# EasyEDA Pro project 毕业设计.eprj, board PCB1
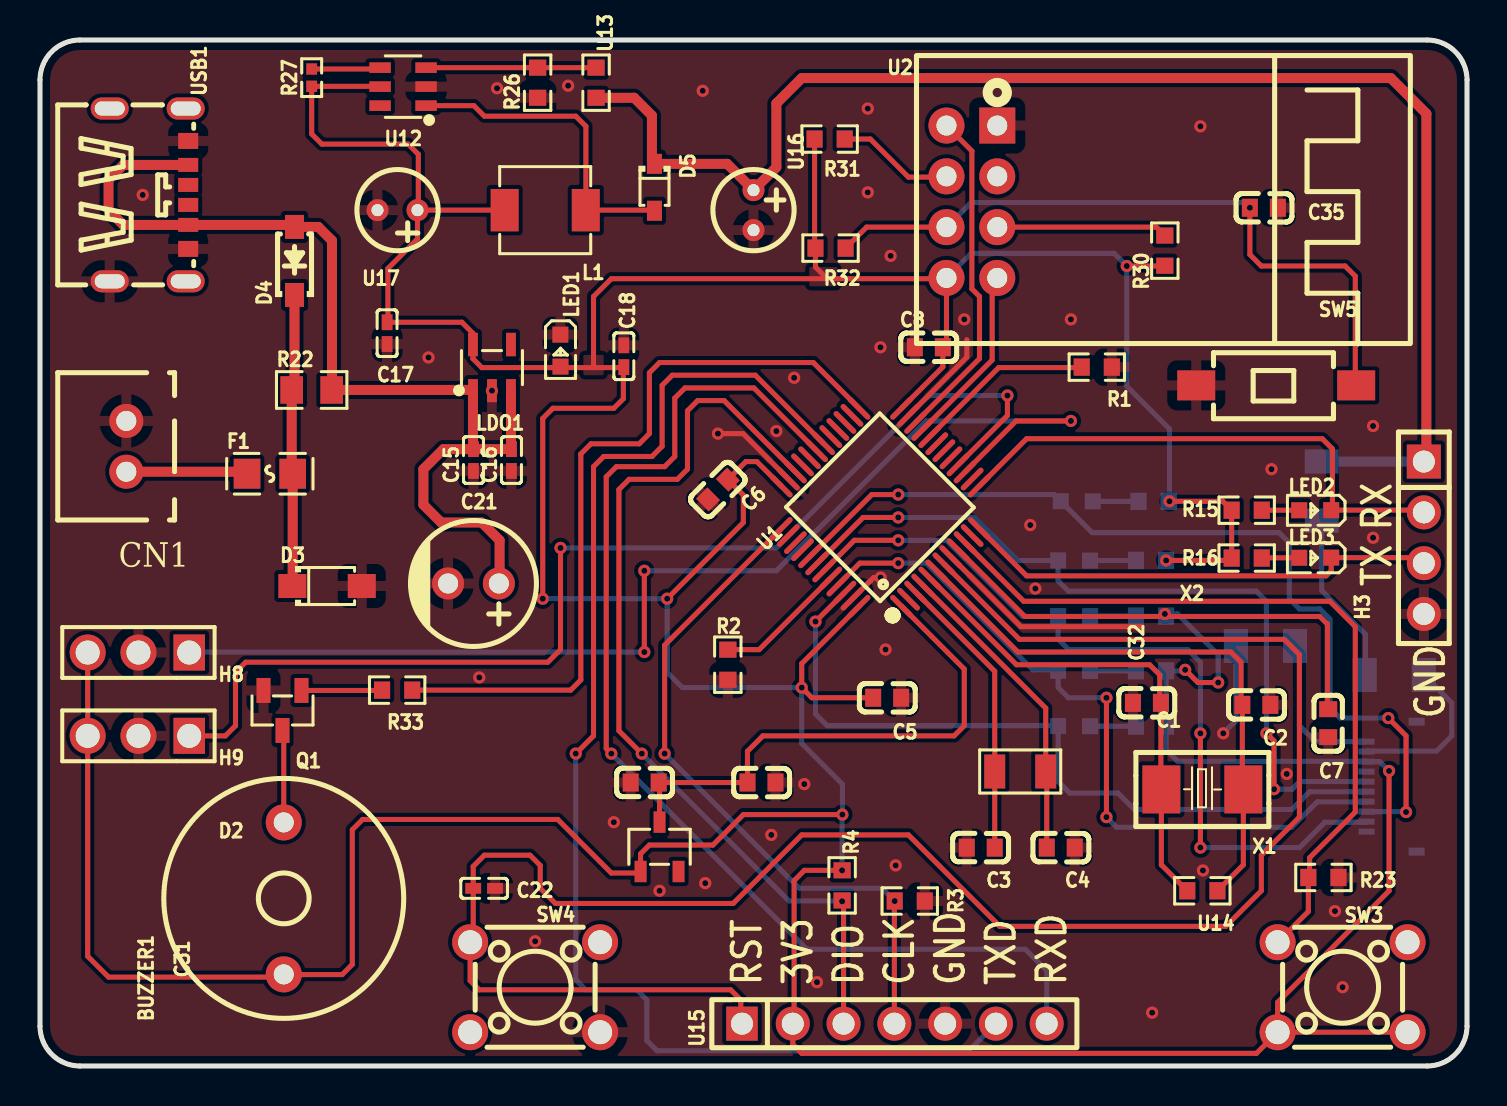
[diagram p3: board, top side]
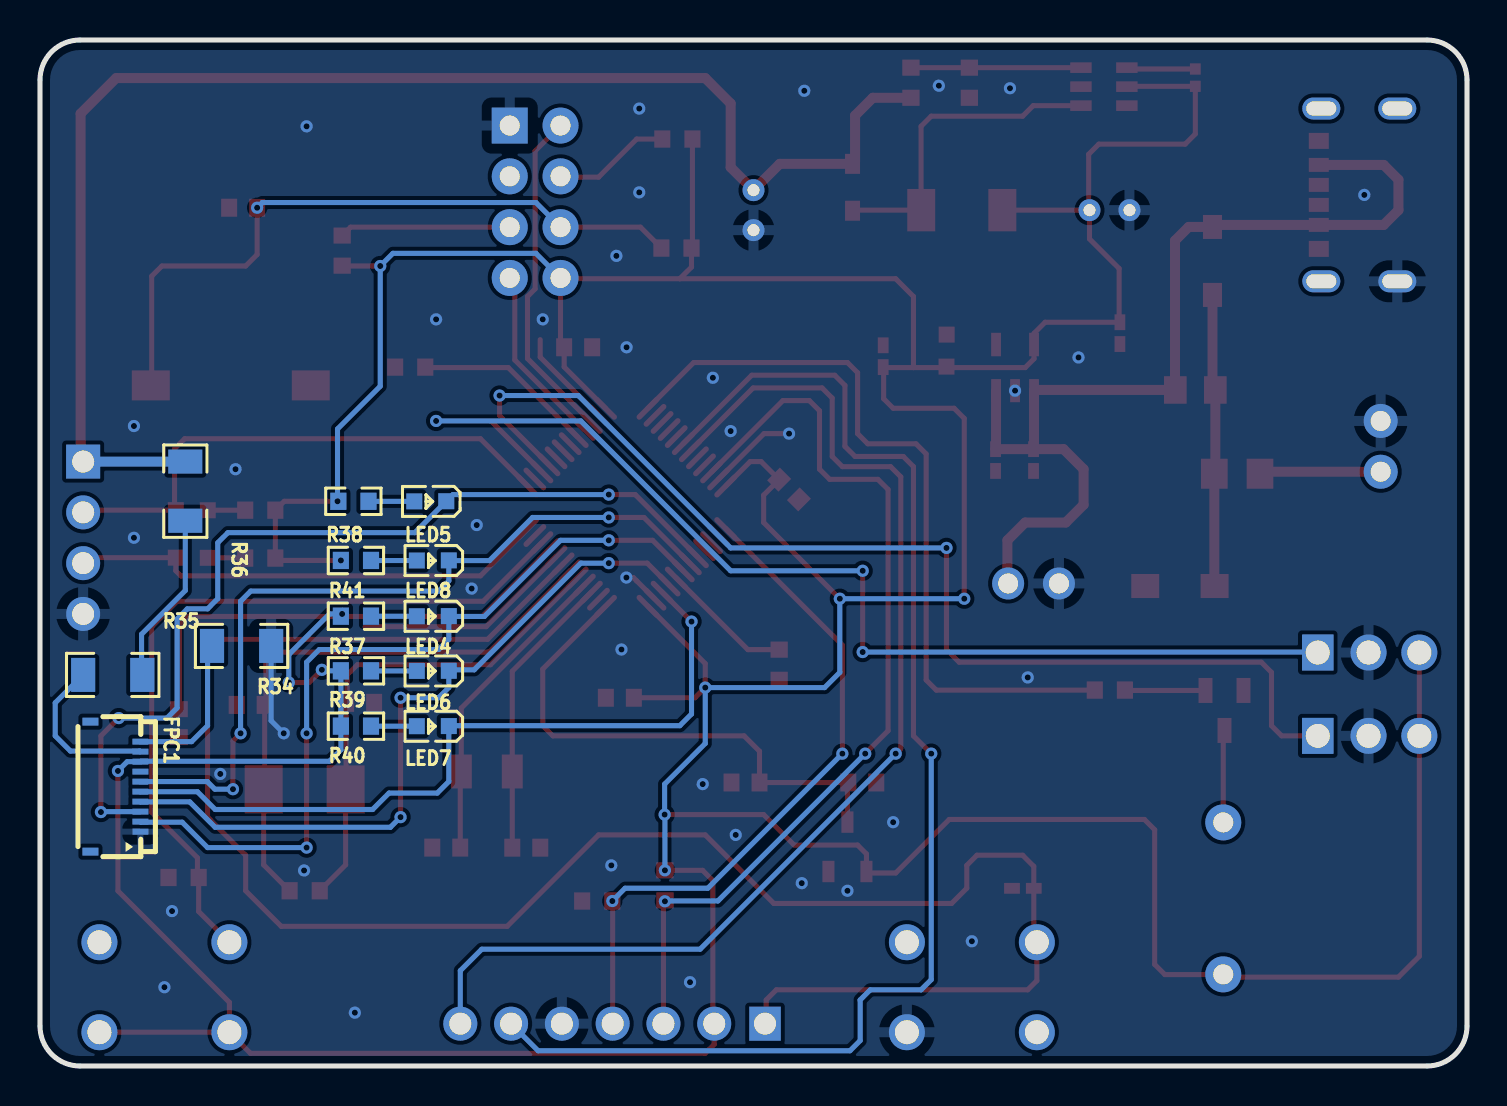
[diagram p4: board, bottom side, seen from below]

Outline 71.37 x 51.31 mm; copper layers: Top Layer, Bottom Layer. Coordinates in mm from the lower left corner of the outline.
Outline path: 0,49.31 0,2 arc(0.59,0.59) 2,0 69.37,0 arc(70.79,0.59) 71.37,2 71.37,49.31 arc(70.79,50.72) 69.37,51.31 2,51.31 arc(0.59,50.72) 0,49.31
Stack: Top Layer 0.035mm / Dielectric1 1.51mm FR4 er 4.5 / Bottom Layer 0.035mm

## Design rules (mm)
template: JLCPCB Capability(Two Layers Board)
spacing copperThickness1oz (default): track to track 0.102, other pairs 0.152 to 0.3
spacing copperThickness2oz: track to track 0.203, other pairs 0.152 to 0.3
track width copperThickness1oz (default): min 0.127, default 0.254, max 2.54
track width copperThickness2oz: min 0.203, default 0.254, max 2.54
differential pair differentialPair (default): width min 0.127, default 0.254, max 2.54; gap min 0.152, default 0.152
via viaSize (default): diameter min 0.5, default 0.61, max 10; hole min 0.3, default 0.305, max 6.3

## Placement (name value [footprint] x y rotation side)
BUZZER1  2.7kHz  [BUZ-TH_BD12.0-P7.60-D0.6-FD]  12.19 8.38 90 top
C1  20pF  [C0603]  55.36 18.16 0 top
C2  20pF  [C0603]  60.84 18.06 180 top
C3  20pF  [C0603]  47.05 10.92 0 top
C4  20pF  [C0603]  51.05 10.92 180 top
C5  100nF  [C0603]  42.37 18.42 180 top
C6  100nF  [C0603]  33.91 28.83 45 top
C7  100nF  [C0603]  64.43 17.15 90 top
C8  100nF  [C0603]  44.46 35.94 0 top
C15  10uF  [C0402]  21.68 30.3 90 top
C16  100nF  [C0402]  23.58 30.3 90 top
C17  10uF  [C0402]  17.36 36.65 90 top
C18  100nF  [C0402]  29.2 35.49 270 top
C21  220uF  [CAP-TH_BD6.3-P2.50-D1.0-FD]  21.68 24.13 180 top
C22  100nF  [C0402]  22.21 8.89 0 top
C31  100nF  [C0603]  30.24 14.18 0 top
C32  100nF  [C0603]  36.09 14.18 180 top
C35  1uF  [C0603]  61.21 42.92 180 top
CN1  B2B-XH-A(LF)(SN)  [CONN-TH_B2B-XH-A-LF-SN]  4.32 30.99 90 top
D2  BAT54C  [SOT-23-3_L2.9-W1.6-P1.90-LS2.8-BR]  30.99 10.96 270 top
D3  SMF5.0A  [SOD-123FL_L2.7-W1.8-LS3.8-RD]  14.36 24 0 top
D4  B5819W SL  [SOD-123_L2.7-W1.6-LS3.7-RD-1]  12.73 40.26 90 top
D5  1SS315TPH3F  [SOD-323_L1.8-W1.3-LS2.5-RD]  30.73 43.94 270 top
F1  BSMD0805-100-6V  [F0805]  11.5 29.62 0 top
FPC1  0.5K-HX-10PWB  [FPC-SMD_10P-P0.50_HDGC_0.5K-HX-10PWB]  67.6 13.97 270 bottom
H3  2.54-1*4P母  [HDR-TH_4P-P2.54-V-F]  69.21 26.42 270 top
H8  2.54-1*3P针  [HDR-TH_3P-P2.54-V-M-1]  4.92 20.68 180 top
H9  2.54-1*3P针  [HDR-TH_3P-P2.54-V-M-1]  4.92 16.51 180 top
L1  4.7uH  [IND-SMD_L4.4-W4.2]  25.27 42.8 180 top
LDO1  ME6211C33M5G-N  [SOT-23-5_L3.0-W1.7-P0.95-LS2.8-BL]  22.61 34.93 0 top
LED1  NCD0603R1  [LED0603-RD_RED]  26.03 35.78 270 top
LED2  19-217/GHC-YR1S2/3T  [LED0603-RD]  63.78 27.8 180 top
LED3  NCD0603B1  [LED0603-RD]  63.78 25.42 180 top
LED4  NCD0603R1  [LED0603-RD_RED]  51.73 22.49 0 bottom
LED5  NCD0603R1  [LED0603-RD_RED]  51.85 28.24 0 bottom
LED6  NCD0603R1  [LED0603-RD_RED]  51.73 19.76 0 bottom
LED7  NCD0603R1  [LED0603-RD_RED]  51.73 17 0 bottom
LED8  NCD0603R1  [LED0603-RD_RED]  51.73 25.28 0 bottom
Q1  S8050  [SOT-23-3_L2.9-W1.3-P1.90-LS2.4-BR]  12.13 17.78 90 top
R1  10kΩ  [R0603]  52.86 34.95 180 top
R2  10kΩ  [R0603]  34.4 20.07 90 top
R3  10kΩ  [R0603]  43.5 8.25 180 top
R4  10kΩ  [R0603]  40.12 9.03 270 top
R15  10kΩ  [R0603]  60.36 27.8 180 top
R16  10kΩ  [R0603]  60.36 25.4 180 top
R22  100mΩ  [R0805]  13.59 33.81 0 top
R23  10kΩ  [R0603]  64.19 9.43 0 top
R26  10kΩ  [R0603]  24.89 49.17 90 top
R27  100kΩ  [R0402]  13.59 49.43 90 top
R30  10kΩ  [R0603]  56.26 40.78 90 top
R31  10kΩ  [R0603]  39.49 46.36 0 top
R32  10kΩ  [R0603]  39.54 40.9 0 top
R33  1kΩ  [R0603]  17.86 18.8 180 top
R34  5.1Ω  [R1206]  61.29 21.01 0 bottom
R35  10Ω  [R1206]  67.74 19.56 180 bottom
R36  10Ω  [R1206]  64.11 28.75 90 bottom
R37  4.7kΩ  [R0603]  55.57 22.49 0 bottom
R38  4.7kΩ  [R0603]  55.7 28.24 0 bottom
R39  4.7kΩ  [R0603]  55.57 19.76 0 bottom
R40  4.7kΩ  [R0603]  55.57 17 0 bottom
R41  4.7kΩ  [R0603]  55.57 25.28 0 bottom
SW3  TS665CJ  [SW-TH_4P-L6.0-W6.0-P4.50-LS6.5]  65.15 3.94 0 top
SW4  TS665CJ  [SW-TH_4P-L6.0-W6.0-P4.50-LS6.5]  24.77 3.94 0 top
SW5  TS-1101-C-W  [SW-SMD_L6.0-W3.3-LS8.0]  61.83 34.04 0 top
U1  STM32F103C8T6  [LQFP-48_L7.0-W7.0-P0.50-LS9.0-BL]  42.03 27.94 45 top
U2  2.4GHz  [WIFIM-TH_8P-L24.7-W14.4-P2.54]  46.61 43.22 0 top
U12  SX1308  [SOT-23-6_L2.9-W1.6-P0.95-LS2.8-BL]  18.16 48.98 90 top
U13  73.2kΩ  [R0603]  27.81 49.17 270 top
U14  1MΩ  [R0603]  58.14 8.76 180 top
U15  PM254-1-07-Z-8.5  [HDR-TH_7P-P2.54-V-F]  42.73 2.12 0 top
U16  22uF  [CAP-TH_BD4.0-P2.00-D0.5-FD]  35.69 42.8 270 top
U17  22uF  [CAP-TH_BD4.0-P2.00-D0.5-FD]  17.88 42.8 180 top
USB1  TYPE-C 6P(073)  [TYPE-C-SMD_TYPE-C-6P]  5.45 43.56 270 top
X1  8MHz  [CRYSTAL-SMD_L5.0-W3.2]  58.14 13.83 180 top
X2  32.768kHz  [OSC-SMD_L3.2-W1.5]  49.03 14.73 180 top

## Footprints (pads in the part's own frame, mm; a bottom-side part is the same pattern mirrored in y, then rotated)
BUZ-TH_BD12.0-P7.60-D0.6-FD
  round 1.8 hole 1: 1(-3.8,0) 2(3.8,0)
C0402
  rect 0.79x0.54 smd: 1(-0.545,0) 2(0.545,0)
C0603
  rect 0.8x0.9 smd: 1(-0.7,0) 2(0.7,0)
CAP-TH_BD4.0-P2.00-D0.5-FD
  round 1.1 hole 0.6: 1(-1,0) 2(1,0)
CAP-TH_BD6.3-P2.50-D1.0-FD
  round 1.6 hole 1: 1(-1.27,0) 2(1.27,0)
CONN-TH_B2B-XH-A-LF-SN
  round 1.7 hole 1: 1(1.27,0) 2(-1.27,0)
CRYSTAL-SMD_L5.0-W3.2
  rect 1.9x2.4 smd: 1(-2.05,0) 2(2.05,0)
F0805
  rect 1.335x1.5 smd: 1(-1.143,0) 2(1.143,0)
FPC-SMD_10P-P0.50_HDGC_0.5K-HX-10PWB
  rect 0.3x0.8 smd: 1(2.25,1.25) 2(1.75,1.25) 3(1.25,1.25) 4(0.75,1.25) 5(0.25,1.25) 6(-0.25,1.25) 7(-0.75,1.25) 8(-1.25,1.25) 9(-1.75,1.25) 10(-2.25,1.25)
  rect 0.4x0.8 smd: 11(-3.25,-1.25) 12(3.25,-1.25)
HDR-TH_3P-P2.54-V-M-1
  rect 1.575x1.8 hole 1.2: 1(-2.54,0)
  round 1.8 hole 1.2: 2(0,0) 3(2.54,0)
HDR-TH_4P-P2.54-V-F
  rect 1.7x1.7 hole 1.1: 1(-3.81,0)
  round 1.7 hole 1.1: 2(-1.27,0) 3(1.27,0) 4(3.81,0)
HDR-TH_7P-P2.54-V-F
  rect 1.575x1.7 hole 1.1: 1(-7.62,0)
  round 1.7 hole 1.1: 2(-5.08,0) 3(-2.54,0) 4(0,0) 5(2.54,0) 6(5.08,0) 7(7.62,0)
IND-SMD_L4.4-W4.2
  rect 1.4x2.12 smd: 1(2.028,0) 2(-2.028,0)
LED0603-RD
  rect 0.8x0.8 smd: 1(-0.799,-0.004) 2(0.799,0.004)
LED0603-RD_RED
  rect 0.8x0.8 smd: 1(-0.799,-0.004) 2(0.799,0.004)
LQFP-48_L7.0-W7.0-P0.50-LS9.0-BL
  oval 0.27x1.5 smd: 1(-2.75,-4.25) 2(-2.25,-4.25) 3(-1.75,-4.25) 4(-1.25,-4.25) 5(-0.75,-4.25) 6(-0.25,-4.25) 7(0.25,-4.25) 8(0.75,-4.25) 9(1.25,-4.25) 10(1.75,-4.25) 11(2.25,-4.25) 12(2.75,-4.25) 25(2.75,4.25) 26(2.25,4.25) 27(1.75,4.25) 28(1.25,4.25) 29(0.75,4.25) 30(0.25,4.25) 31(-0.25,4.25) 32(-0.75,4.25) 33(-1.25,4.25) 34(-1.75,4.25) 35(-2.25,4.25) 36(-2.75,4.25)
  oval 1.5x0.27 smd: 13(4.25,-2.75) 14(4.25,-2.25) 15(4.25,-1.75) 16(4.25,-1.25) 17(4.25,-0.75) 18(4.25,-0.25) 19(4.25,0.25) 20(4.25,0.75) 21(4.25,1.25) 22(4.25,1.75) 23(4.25,2.25) 24(4.25,2.75) 37(-4.25,2.75) 38(-4.25,2.25) 39(-4.25,1.75) 40(-4.25,1.25) 41(-4.25,0.75) 42(-4.25,0.25) 43(-4.25,-0.25) 44(-4.25,-0.75) 45(-4.25,-1.25) 46(-4.25,-1.75) 47(-4.25,-2.25) 48(-4.25,-2.75)
OSC-SMD_L3.2-W1.5
  rect 1.05x1.7 smd: 1(-1.275,0) 2(1.275,0)
R0402
  rect 0.566x0.54 smd: 1(-0.433,0) 2(0.433,0)
R0603
  rect 0.806x0.864 smd: 1(-0.753,0) 2(0.753,0)
R0805
  rect 1.133x1.377 smd: 1(-1,0) 2(1,0)
R1206
  rect 1.208x1.701 smd: 1(-1.479,0) 2(1.479,0)
SOD-123_L2.7-W1.6-LS3.7-RD-1
  rect 1.2x0.95 smd: 1(-1.7,0) 2(1.7,0)
SOD-123FL_L2.7-W1.8-LS3.8-RD
  rect 1.4x1.2 smd: 1(-1.735,0) 2(1.735,0)
SOD-323_L1.8-W1.3-LS2.5-RD
  rect 1x0.75 smd: 1(-1.173,0) 2(1.173,0)
SOT-23-3_L2.9-W1.3-P1.90-LS2.4-BR
  rect 1.25x0.7 smd: 1(1,-0.95) 2(1,0.95) 3(-1,0)
SOT-23-3_L2.9-W1.6-P1.90-LS2.8-BR
  rect 1.07x0.6 smd: 1(1.235,-0.95) 2(1.235,0.95) 3(-1.235,0)
SOT-23-5_L3.0-W1.7-P0.95-LS2.8-BL
  rect 0.49x1.157 smd: 1(-0.95,-1.153) 2(0,-1.153) 3(0.95,-1.153)
  rect 0.49x1.175 smd: 4(0.95,1.153) 5(-0.95,1.153)
SOT-23-6_L2.9-W1.6-P0.95-LS2.8-BL
  rect 0.532x1.072 smd: 1(-0.95,-1.149) 2(0,-1.149) 3(0.95,-1.149) 4(0.95,1.149) 5(0,1.149) 6(-0.95,1.149)
SW-SMD_L6.0-W3.3-LS8.0
  rect 1.9x1.5 smd: 1(-4,0) 2(4,0)
SW-TH_4P-L6.0-W6.0-P4.50-LS6.5
  round 1.8 hole 1.2: 1(-3.25,2.25) 2(3.25,2.25) 3(-3.25,-2.25) 4(3.25,-2.25)
TYPE-C-SMD_TYPE-C-6P
  oval 1.1x1.9 hole 0.7x1.5: 7(-4.32,1.837) 7(-4.32,-1.962) 7(4.32,1.837) 7(4.32,-1.962)
  rect 0.7x1 smd: A5(-0.5,1.962) A9(1.5,1.962) B5(0.5,1.962) B9(-1.5,1.962)
  rect 0.8x1 smd: A12(2.7,1.962) B12(-2.7,1.962)
WIFIM-TH_8P-L24.7-W14.4-P2.54
  rect 1.8x1.8 hole 1: 1(1.27,3.81)
  round 1.8 hole 1: 2(1.27,1.27) 3(1.27,-1.27) 4(1.27,-3.81) 5(-1.27,3.81) 6(-1.27,1.27) 7(-1.27,-1.27) 8(-1.27,-3.81)

## Nets
As in the schematic.

Pads without a net: D2 2; FPC1 7 11 12; LDO1 4; SW3 2; SW4 2 3; U1 2 11 14 17 18 19 26 27 28 29 32 33 38 39 40; U2 2; U12 6; USB1 A5 B5

## Via types
v1: diameter 0.61, hole 0.305, Top Layer to Bottom Layer, 75 vias

## Routing (per net, layer and track width the routed paths; a pad name or vN(x,y) marks a point on that pad's centre or on a via; arc(x,y) is an arc through that point)
3V3: length 339.2
  Top Layer w0.254: v1(40.13,12.57) 35.18,12.57 33.66,11.05 30.48,11.05 30.04,10.61 D2.1 29.96,9.65 28.58,9.65 25.9,12.33 16.14,12.33 15.62,11.82 15.62,5.08 15.11,4.57 12.2,4.57 BUZZER1.1 12.06,4.45 3.43,4.45 2.39,5.49 2.39,20.68 ; U1.36 35.85,30.23 35.31,30.23 C6.2 35.18,28.55 35.18,27.18 v1(31.37,23.37) ; 25.98,34.93 27.68,34.93 ; 25.98,34.93 22.1,34.93 21.66,35.37 LDO1.5 21.66,36.64 21.1,37.19 C17.2 17.4,37.23 17.4,39.88 18.88,41.36 U17.1 ; 25.98,34.93 LED1.2 ; 27.68,34.93 29.18,34.93 ; 27.68,34.93 27.69,34.93 27.69,38.48 28.58,39.37 39.37,39.37 ; 39.37,39.37 38.79,39.95 R32.1 38.74,40.95 R31.1 ; 39.37,39.37 45.3,39.37 U2.8 45.34,36.12 C8.2 45.16,34.96 U1.24 ; 29.18,34.93 29.18,33.37 28.7,32.89 25.65,32.89 25.15,32.39 v1(25.15,23.37) ; 29.18,34.93 29.2,34.95 ; v1(57.28,19.81) 57.91,19.18 v1(58.93,19.18) ; R30.1 56.24,40.01 v1(54.36,40.01) ; U1.48 38.1,20.12 v1(38.1,18.92) 38.61,18.42 C5.2 ; v1(56.49,28.24) 59.16,28.24 R15.2 R16.2 59.48,25.28 v1(56.32,25.28) ; U1.9 49.26,22.48 64.01,22.48 64.39,22.1 64.39,17.89 C7.2 ; v1(40.12,9.79) 38.23,9.79 37.72,9.27 37.72,2.18 U15.2 37.65,1.08 38.1,0.64 60.85,0.64 SW3.3 ; SW3.3 61.9,3.18 67.48,8.76 v1(67.48,14.76) ; SW3.3 SW3.4 ; U17.1 18.92,42.84 18.92,45.59 18.42,46.1 14.1,46.1 13.59,46.61 R27.1 16.99,48.99 U12.5 ; U17.1 L1.1
  Bottom Layer w0.254: v1(56.26,22.61) 56.9,22.61 58.93,20.57 v1(58.93,19.18) ; v1(40.12,9.79) 40.12,12.56 v1(40.13,12.57) 40.13,14.1 38.1,16.13 v1(38.1,18.92) 32.13,18.92 31.37,19.69 v1(31.37,23.37) v1(25.15,23.37) ; v1(56.49,28.24) 56.49,31.86 54.36,33.99 v1(54.36,40.01) 53.72,40.64 46.57,40.64 U2.8 ; v1(57.28,19.81) 57.23,19.76 R39.2 R40.2 56.32,15.81 56.9,15.24 66.33,15.24 FPC1.8 67.01,15.22 v1(67.48,14.76)
4V2_IN: length 14.6
  Top Layer w0.5: D4.1 12.73,33.95 R22.1 12.59,29.67 F1.2 12.64,24.02 D3.1
+5V: length 72.3
  Top Layer w0.5: H3.1 69.34,30.35 69.34,47.63 67.56,49.4 38.1,49.4 36.83,48.13 36.83,44.94 U16.1 34.37,45.11 D5.1 30.61,45.24 30.61,47.53 29.72,48.42 U13.2
  Bottom Layer w0.5: R36.2 H3.1
GND: length 27
  Top Layer w0.254: U1.23 46.36,35.45 46.36,36.32 ; 40.61,23.34 41.53,24.26 41.53,24.26 41.7,24.43 v1(42.05,24.43) ; 55.12,21.97 49.06,21.97 45.56,25.47 ; v1(33.91,31.62) 35.16,31.62 U1.35
  Bottom Layer w0.254: R34.1 59.81,17.27 v1(59.18,16.64)
  vias: v1(5.14,43.56) v1(19.43,35.43) v1(21.97,19.43) v1(22.61,33.77) v1(22.86,48.9) v1(24.77,6.24) v1(26.42,49.02) v1(28.7,12.19) v1(30.99,8.76) v1(33.15,48.77) v1(33.27,9.14) v1(36.58,11.56) v1(36.83,31.75) v1(37.72,34.42) v1(38.23,14.1) v1(38.86,4.19) v1(41.4,47.88) v1(41.4,43.69) v1(42.04,35.94) v1(42.29,20.83) v1(42.55,40.51) v1(42.8,10.03) v1(46.23,37.34) v1(49.53,27.05) v1(49.78,23.88) v1(51.56,37.34) v1(55.63,2.67) v1(58.04,46.99) v1(58.17,9.78) v1(61.6,29.85) v1(62.36,14.61) v1(64.77,7.75) v1(65.15,3.94) v1(66.67,32) v1(66.67,26.42)
VBAT: length 26.6
  Top Layer w0.254: 30.99,14.13 30.95,14.18 ; 30.99,14.13 31.03,14.18 C32.2 35.39,15.74 36.16,16.51 45.72,16.51 46.23,17.02 46.23,19.85 U1.1 ; 30.99,14.13 D2.3
VBUS: length 51.4
  Top Layer w0.5: C15.2 21.66,30.87 LDO1.1 21.62,33.81 R22.2 14.61,33.82 14.61,41.28 13.92,41.96 D4.2 12.63,42.06 4.17,42.06 3.43,42.8 3.43,44.32 4.17,45.06 7.41,45.06 ; C15.2 C16.2 23.56,30.87 LDO1.3 ; C15.2 20.18,30.85 19.18,29.85 19.18,28.07 20.07,27.18 22.1,27.18 22.99,26.29 22.99,24.17 C21.1
BOOT0: length 6.6
  Top Layer w0.254: R2.2 35.97,20.82 U1.44
BOOT1: length 9
  Top Layer w0.254: R1.2 52.08,34.93 47.95,34.93 U1.20
BUZZER: length 38.5
  Top Layer w0.254: U1.25 38.68,35.18 30.99,35.18 30.48,34.67 30.48,31.62 29.97,31.12 27.56,31.12 27.05,30.61 27.05,19.3 26.54,18.8 18.62,18.8 R33.1
CS: length 38.2
  Top Layer w0.254: U1.46 v1(38.79,22.23)
  Bottom Layer w0.254: FPC1.5 66.35,13.72 63.5,13.72 62.61,12.83 54.74,12.83 53.92,13.65 51.5,13.65 50.92,14.23 LED7.1 50.91,17.02 39.37,17.02 38.79,17.6 v1(38.79,22.23)
DC: length 36.9
  Top Layer w0.254: 39.91,24.05 41,25.15 v1(42.93,25.15) ; v1(53.34,18.42) v1(53.34,12.45)
  Bottom Layer w0.254: FPC1.4 66.34,13.21 63.88,13.21 62.61,11.94 53.85,11.94 v1(53.34,12.45) ; v1(42.93,25.15) 44.32,25.15 49.66,19.81 50.88,19.81 LED6.1 50.92,18.93 51.44,18.42 v1(53.34,18.42)
ESP_EN: length 5.9
  Top Layer w0.254: R31.2 41.53,46.36 43.43,44.45 45.3,44.45 U2.6
ESP_RST: length 34.8
  Top Layer w0.254: R32.2 41.34,41.95 U2.7 ; SW5.2 65.79,34.08 65.79,39.5 65.28,40.01 61.09,40.01 60.51,40.58 v1(60.51,42.92)
  Bottom Layer w0.254: v1(60.51,42.92) 60.25,43.18 46.57,43.18 U2.7
FAN: length 57
  Top Layer w0.254: H9.1 9.27,16.51 9.78,17.02 9.78,19.69 10.29,20.19 25.4,20.19 26.04,20.83 v1(26.04,25.91) ; v1(48.39,33.53) 48.39,32.53 U1.16
  Bottom Layer w0.254: v1(26.04,25.91) 36.83,25.91 44.45,33.53 v1(48.39,33.53)
IO0: length 8.6
  Top Layer w0.254: U2.3 55.84,41.95 R30.2
MOTOR: length 57.6
  Top Layer w0.254: U1.15 48.82,32.26 v1(51.56,32.26) ; v1(30.23,24.77) v1(30.23,20.7)
  Bottom Layer w0.254: H8.1 7.49,20.7 v1(30.23,20.7) ; v1(51.56,32.26) 44.32,32.26 36.83,24.77 v1(30.23,24.77)
NRST: length 98.6
  Top Layer w0.254: 45.21,25.11 48.98,21.34 62.23,21.34 62.99,20.57 62.99,12.45 61.09,10.54 61.09,8.76 59.31,6.99 48.01,6.99 43.43,11.56 38.1,11.56 34.67,8.13 25.78,8.13 25.02,8.89 25.02,10.03 24.51,10.54 22.23,10.54 21.67,9.98 C22.1 21.67,6.34 SW4.1 21.52,4.27 21.97,3.81 34.54,3.81 35.05,3.3 35.05,2.18 U15.1
OSC32_IN: length 14.4
  Top Layer w0.254: U1.3 47.75,19.74 X2.2 C3.2
OSC32_OUT: length 15.7
  Top Layer w0.254: 44.15,24.05 50.3,17.9 X2.1 50.35,14.68 C4.2
OSC_IN: length 24.9
  Top Layer w0.254: U14.2 56.09,10.06 X1.2 56.06,13.85 C1.2 56.01,18.22 56.01,19.56 55.5,20.07 48.84,20.07 U1.5
OSC_OUT: length 29.1
  Top Layer w0.254: U14.1 60.19,10.06 60.19,13.83 60.14,13.88 C2.2 60.07,18.12 60.07,20.19 59.56,20.7 48.91,20.7 U1.6
RES: length 40.8
  Top Layer w0.254: v1(42.93,26.29) 40.73,26.29 U1.43 ; v1(58.04,16.64) v1(58.04,10.92)
  Bottom Layer w0.254: v1(58.04,10.92) 62.99,10.92 64.26,12.19 66.32,12.19 FPC1.2 ; v1(42.93,26.29) 45.34,26.29 49.15,22.48 50.91,22.48 LED4.1 50.92,21.34 51.44,20.83 57.4,20.83 58.04,20.19 v1(58.04,16.64)
SCL: length 46.2
  Top Layer w0.254: v1(67.44,17.4) 68.33,16.51 v1(68.33,12.7) ; v1(42.93,28.58) 41.6,28.58 38.49,25.47
  Bottom Layer w0.254: FPC1.3 68.31,12.72 v1(68.33,12.7) ; v1(42.93,28.58) 50.72,28.58 LED5.1 52.63,26.67 61.98,26.67 62.48,26.16 62.48,23.37 62.99,22.86 64.01,22.86 64.52,22.35 64.52,17.91 65.02,17.4 v1(67.44,17.4)
SDA: length 40.1
  Top Layer w0.254: U1.42 41.17,27.43 v1(42.93,27.43) ; v1(61.72,13.84) 61.72,16.26 v1(61.34,16.64)
  Bottom Layer w0.254: v1(61.34,16.64) 61.34,23.24 60.83,23.75 51.44,23.75 50.92,24.26 50.92,25.29 50.91,25.27 48.89,25.27 46.74,27.43 v1(42.93,27.43) ; FPC1.6 66.35,14.22 63.01,14.22 62.63,13.84 v1(61.72,13.84)
SWCLK: length 34.4
  Top Layer w0.254: U15.4 42.73,8.23 v1(42.75,8.25) ; U1.37 31.24,21.04 v1(31.24,15.62)
  Bottom Layer w0.254: v1(31.24,15.62) 37.97,8.89 42.11,8.89 v1(42.75,8.25)
SWDIO: length 46.8
  Top Layer w0.254: v1(30.1,15.62) 28.96,16.76 28.96,28.83 29.46,29.34 31.88,29.34 32.39,29.85 32.39,32.77 32.89,33.27 34.22,33.27 U1.34 ; R4.2 40.19,8.21 U15.3
  Bottom Layer w0.254: v1(30.1,15.62) 37.46,8.26 40.1,8.26 v1(40.12,8.24)
USART1_RX: length 58.2
  Top Layer w0.254: v1(28.58,15.62) 28.32,15.88 28.32,29.46 28.83,29.97 31.24,29.97 31.75,30.48 31.75,33.4 32.26,33.91 35.7,33.91 U1.31
  Bottom Layer w0.254: v1(28.58,15.62) 38.35,5.84 49.28,5.84 50.35,4.77 U15.7
USART1_TX: length 66.9
  Top Layer w0.254: U1.30 35.78,34.54 31.62,34.54 31.11,34.04 31.11,30.99 30.61,30.48 28.19,30.48 27.69,29.97 27.69,16.51 v1(26.8,15.62)
  Bottom Layer w0.254: v1(26.8,15.62) 26.8,4.32 27.3,3.81 29.85,3.81 30.35,3.3 30.35,1.27 30.86,0.76 46.46,0.76 U15.6
USART2_RX: length 26.6
  Top Layer w0.254: 46.98,29 49.35,31.37 64.14,31.37 64.64,30.86 64.64,27.86 LED2.1 69.1,27.8 H3.2
USART2_TX: length 24.1
  Top Layer w0.254: H3.3 68.94,25.42 LED3.1 64.58,24.77 64.33,24.51 49.35,24.51 46.98,26.88
USART3_RX: length 16.9
  Top Layer w0.254: U1.22 46.99,35.38 46.99,38.48 46.61,38.86 46.61,45.76 U2.5
USART3_TX: length 9.1
  Top Layer w0.254: U2.4 47.63,39.16 47.63,35.31 44.15,31.83
WKUP: length 38.6
  Top Layer w0.254: U1.10 49.2,23.24 64.52,23.24 65.79,21.97 65.79,12.7 63.5,10.41 63.5,9.49 R23.1 63.44,7.73 SW3.1
$1N2237: length 6.1
  Top Layer w0.5: CN1.2 10.25,29.72 F1.1
$1N2248: length 3.5
  Top Layer w0.254: U12.4 16.94,49.86 R27.2
$1N2251: length 16.1
  Top Layer w0.254: U12.1 21.7,48.03 22.23,47.5 26.8,47.5 27.3,46.99 27.3,42.81 L1.2 30.7,42.8 D5.2
$1N2252: length 8.5
  Top Layer w0.254: U12.3 R26.2 U13.1
$1N6365: length 1.9
  Top Layer w0.254: R15.1 62.98,27.8 62.98,27.79
$1N6366: length 1.9
  Top Layer w0.254: 62.98,25.42 61.12,25.42 R16.1
$1N8183: length 4
  Top Layer w0.254: Q1.1 17.09,18.78 R33.2
$1N8188: length 4.6
  Top Layer w0.254: BUZZER1.2 12.19,16.72 Q1.3
$1N12182: length 7.8
  Bottom Layer w0.254: FPC1.10 63.79,16.22 62.99,17.02 62.99,20.79 R34.2
$1N12860: length 8.2
  Bottom Layer w0.254: R35.1 70.61,18.16 70.61,16.51 69.85,15.75 66.38,15.75 FPC1.9
$1N13353: length 2.3
  Bottom Layer w0.254: LED4.2 54.81,22.49 R37.1
$1N13356: length 2.3
  Bottom Layer w0.254: LED5.2 54.94,28.24 54.95,28.24
$1N13362: length 2.3
  Bottom Layer w0.254: R39.1 54.81,19.76 LED6.2
$1N13365: length 2.3
  Bottom Layer w0.254: LED7.2 54.81,16.99 R40.1
$1N13368: length 2.3
  Bottom Layer w0.254: R41.1 54.81,25.28 LED8.2
$1N24150: length 8.6
  Bottom Layer w0.254: R35.2 66.29,19.59 66.29,21.59 64.11,23.78 R36.1

## Copper pours and planes (outline as drawn; the poured copper is in the pictures)
3V3 on Top Layer: 38.48,39.95 39.88,39.95 39.88,38.99 38.48,38.99
3V3 on Top Layer: 27.18,35.56 28.19,35.56 28.19,34.54 27.18,34.54
GND on Top Layer: -21.59,66.29 74.3,66.29 74.3,-3.05 -21.59,-3.05
GND on Bottom Layer: -4.57,55.25 85.73,55.25 85.73,-14.86 -4.57,-14.86

## Text on the board
Top Silkscreen Layer: RST | 3V3 | DIO | CLK | GND | TXD | RXD | RX | TX
